# Altium schematic sheet [4]GNSS.SchDoc
size A
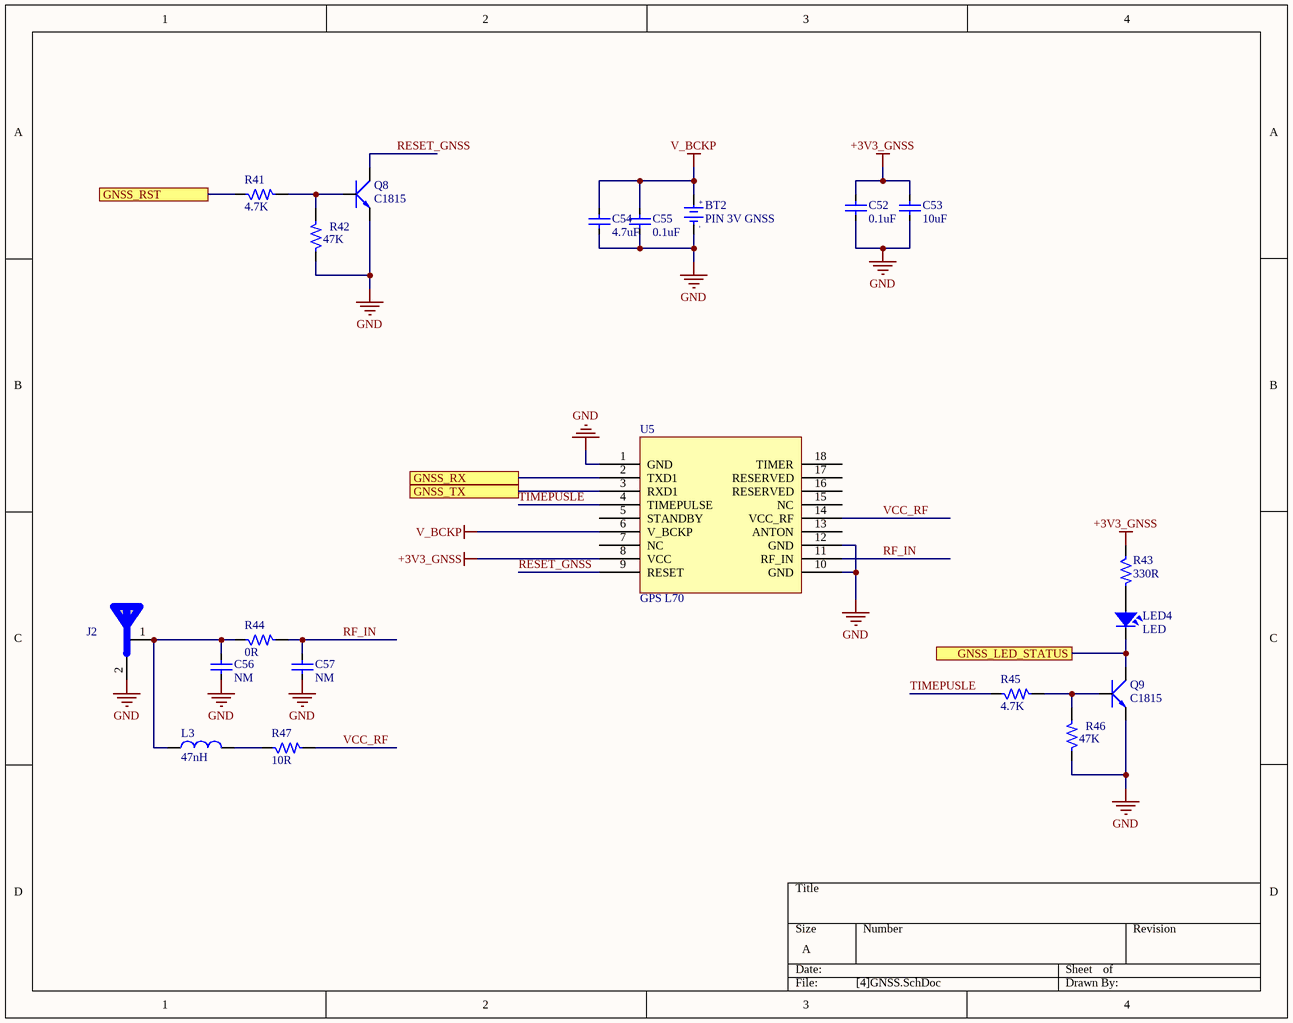
[diagram p0: [4]GNSS.SchDoc]

## Parts
BT2  PIN 3V GNSS  [CR1220 SMD]
C52  0.1uF  [CAP_0805]
C53  10uF  [CAP_0805]
C54  4.7uF  [CAP_0805]
C55  0.1uF  [CAP_0805]
C56  NM  [CAP_0805]
C57  NM  [CAP_0805]
J2  GPS_ANTENNA  [Antenna-MCX5.08-H5]  (value not drawn)
L3  47nH  [RES-SMD-0805]
LED4  LED  [LED-0805-Red]
Q8  C1815  [SOT23B]
Q9  C1815  [SOT23B]
R41  4.7K  [R0805]
R42  47K  [R0805]
R43  330R  [R0805]
R44  0R  [R0805]
R45  4.7K  [R0805]
R46  47K  [R0805]
R47  10R  [R0805]
U5  GPS L70  [GPS L70]

## Ports
GNSS_LED_STATUS, GNSS_RST, GNSS_RX, GNSS_TX

## Nets
+3V3_GNSS: C52.2 C53.2 R43.1 U5.8(VCC)
GND: BT2.2(GND) C52.1 C53.1 C54.1 C55.1 C56.1 C57.1 J2.2(GND) Q8.1(E) Q9.1(E) R42.1 R46.1 U5.1(GND) U5.10(GND) U5.12(GND)
V_BCKP: BT2.1(+3V) C54.2 C55.2 U5.6(V_BCKP)
GNSS_LED_STATUS: LED4.2 Q9.2(C) ; port GNSS_LED_STATUS
GNSS_RST: R41.1 ; port GNSS_RST
GNSS_RX: U5.2(TXD1) ; port GNSS_RX
GNSS_TX: U5.3(RXD1) ; port GNSS_TX
RESET_GNSS: Q8.2(C) U5.9(RESET)
RF_IN: C57.2 R44.2 U5.11(RF_IN)
TIMEPUSLE: R45.1 U5.4(TIMEPULSE)
VCC_RF: R47.2 U5.14(VCC_RF)
NetC56_2: C56.2 J2.1(GND) L3.1 R44.1
NetL3_2: L3.2 R47.1
NetLED4_1: LED4.1 R43.2
NetQ8_3: Q8.3(B) R41.2 R42.2
NetQ9_3: Q9.3(B) R45.2 R46.2

Not connected (* = marked no-connect by the designer): U5 5(STANDBY) 7(NC) 13(ANTON) 15(NC) 16(RESERVED) 17(RESERVED) 18(TIMER)

## Notes on the sheet
- (in symbol PIN 3V) +; -

## Library data of the parts
BT2 = PIN 3V: Battery 3VDC; Value: PIN 3V
C52-C57 = CapSMD: Capacitor; Value: 33p; Published: 8-Jun-2000; LatestRevisionDate: 17-Jul-2002; LatestRevisionNote: Re-released for DXP Platform.; PackageReference: RAD-0.3; Publisher: Altium Limited
J2 = ANTEN
L3 = L1: Inductor; Value: 150 mH
LED4 = LED: LED Single colour Green and Red; Value: LED 3 ly Single Colour
Q8 Q9 = C1815: NPN 600mW, ECB; Value: C1815
R41-R47 = RM: Resistor SMD; Value: 1K